# EAGLE design Motor Controller (EAGLE 8.5.1)
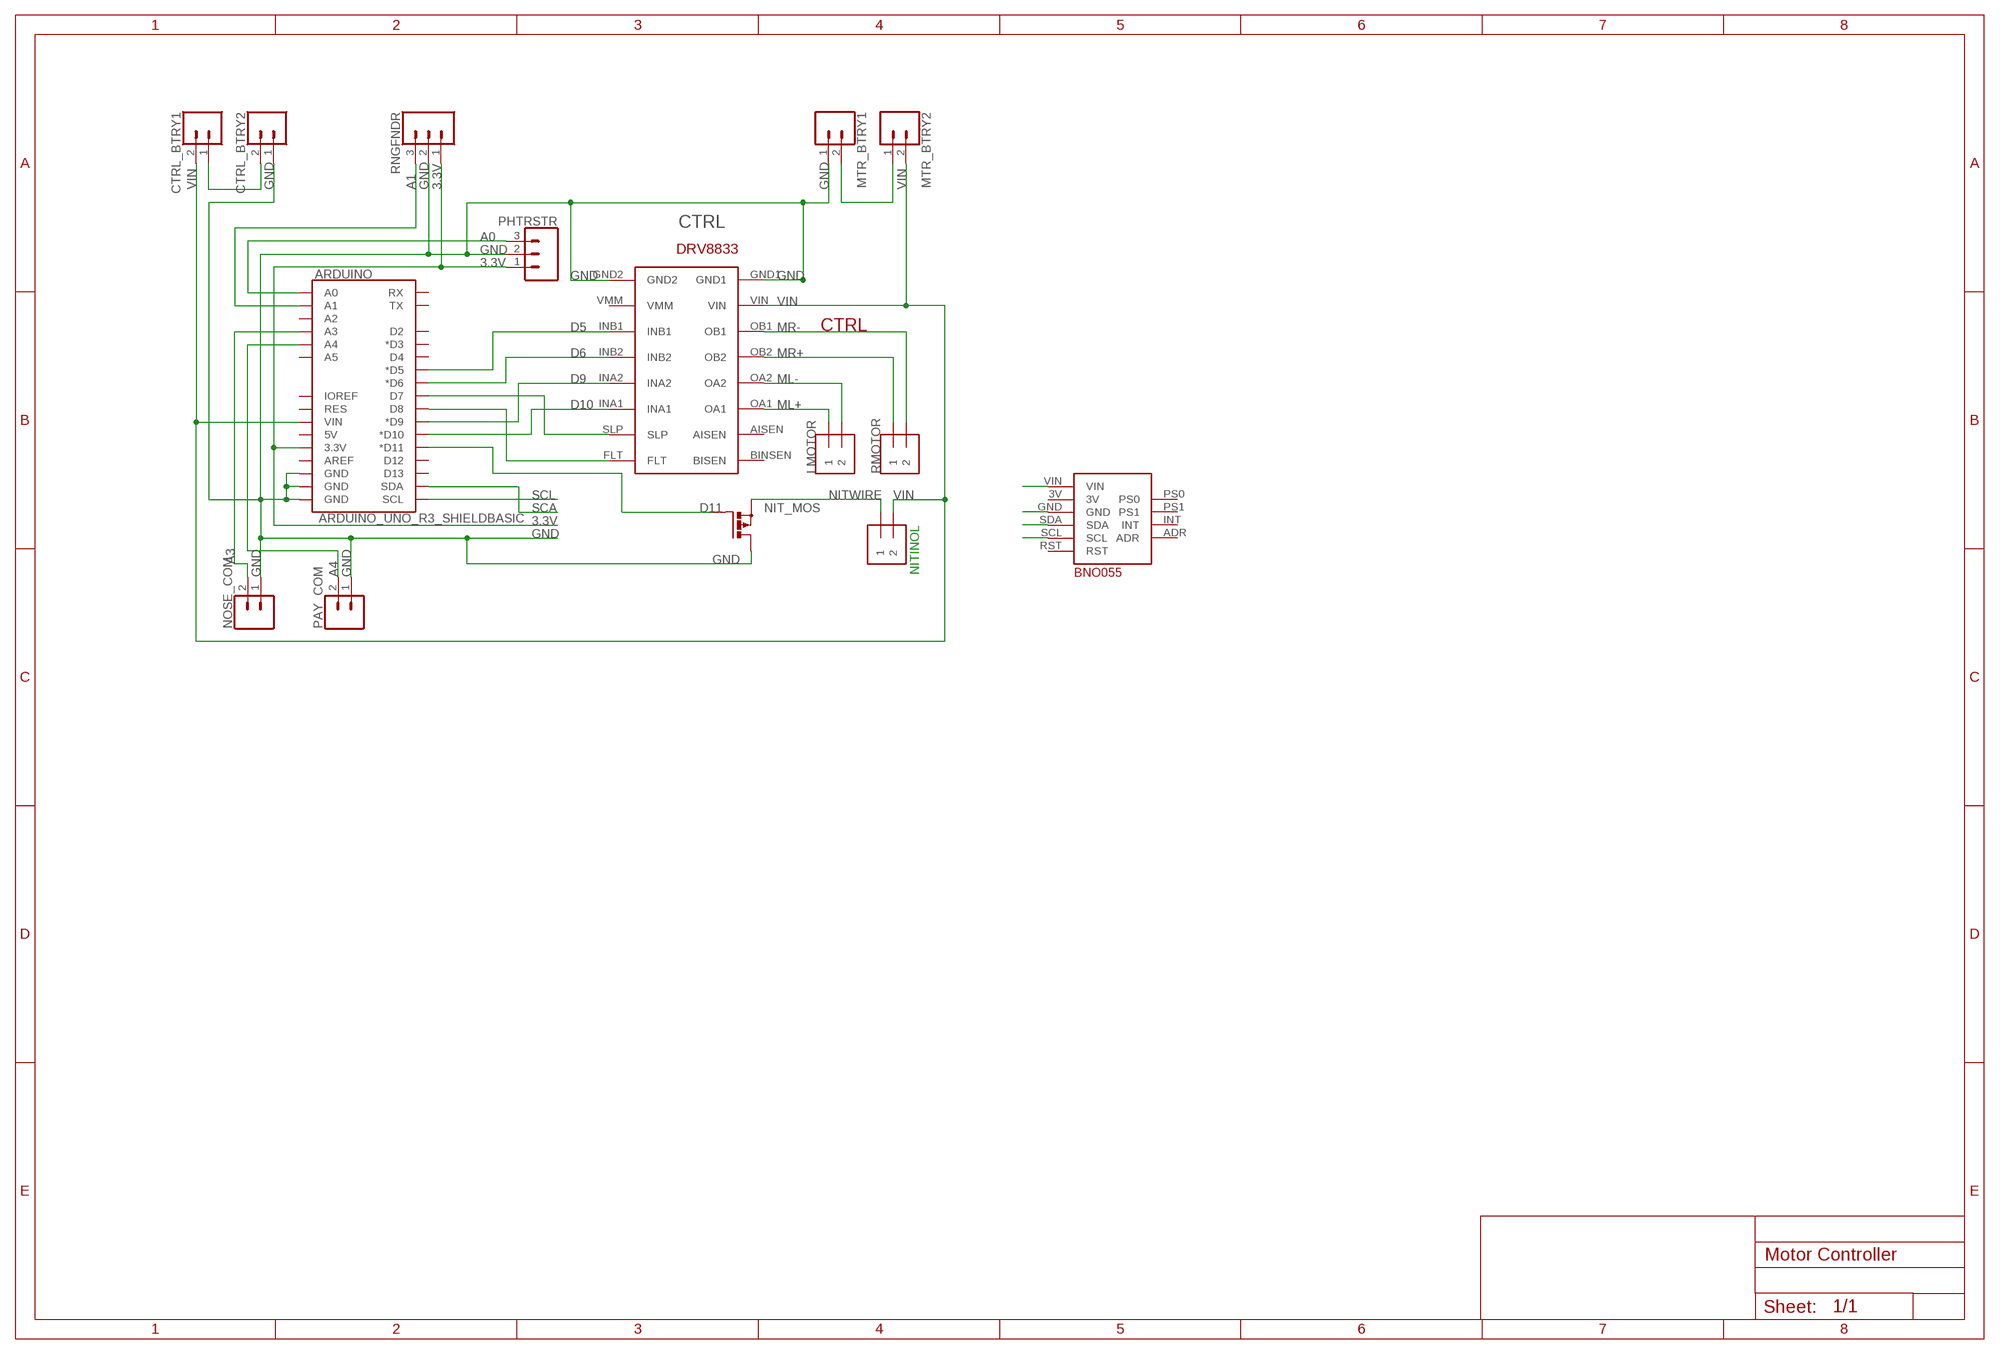
[diagram p0: schematic, sheet 1]

## Parts
ARDUINO  ARDUINO_UNO_R3_SHIELDBASIC  [UNO_R3_SHIELD]
CTRL  POLOLU-DRV8833  [POLOLU-DRV8833]
CTRL_BTRY1  CONN_02-JST-2-PTH-NO_SILK  [JST-2-PTH-NS]
CTRL_BTRY2  CONN_02-JST-2-PTH-NO_SILK  [JST-2-PTH-NS]
LMOTOR  1X2-3.5MM  [1X2-3.5MM]
MTR_BTRY1  CONN_02-JST-2-PTH-NO_SILK  [JST-2-PTH-NS]
MTR_BTRY2  CONN_02-JST-2-PTH-NO_SILK  [JST-2-PTH-NS]
NIT_MOS  PMOSFET_PTO220BH  [TO220BH]
NITINOL  1X2-3.5MM  [1X2-3.5MM]
NOSE_COM  CONN_02JST-PTH-2  [JST-2-PTH]
PAY_COM  CONN_02JST-PTH-2  [JST-2-PTH]
PHTRSTR  CONN_03JST-PTH-NS  [JST-3-PTH-NS]
RMOTOR  1X2-3.5MM  [1X2-3.5MM]
RNGFNDR  CONN_03JST-PTH-NS  [JST-3-PTH-NS]
U$1  BNO055  [BNO055]

## Nets
3.3V: ARDUINO.3.3V PHTRSTR.1 RNGFNDR.1 U$1.VIN
A0: ARDUINO.A0 PHTRSTR.3
A1: ARDUINO.A1 RNGFNDR.3
A3: ARDUINO.A3 NOSE_COM.2
A4: ARDUINO.A4 PAY_COM.2
BAT_INT1: MTR_BTRY1.2 MTR_BTRY2.1
BAT_INT2: CTRL_BTRY1.1 CTRL_BTRY2.2
D5: ARDUINO.D5(*D5) CTRL.INB1
D6: ARDUINO.D6(*D6) CTRL.INB2
D9: ARDUINO.D9(*D9) CTRL.INA2
D10: ARDUINO.D10(*D10) CTRL.INA1
D11: ARDUINO.D11(*D11) NIT_MOS.G
GND: ARDUINO.GND@0(GND) ARDUINO.GND@1(GND) ARDUINO.GND@2(GND) CTRL.GND1 CTRL.GND2 CTRL_BTRY2.1 MTR_BTRY1.1 NIT_MOS.D NOSE_COM.1 PAY_COM.1 PHTRSTR.2 RNGFNDR.2 U$1.GND
ML+: CTRL.OA1 LMOTOR.1
ML-: CTRL.OA2 LMOTOR.2
MR+: CTRL.OB2 RMOTOR.1
MR-: CTRL.OB1 RMOTOR.2
N$2: ARDUINO.D7 CTRL.SLP
N$3: ARDUINO.D8 CTRL.FLT
NITWIRE: NIT_MOS.S NITINOL.1
SCA: ARDUINO.SDA U$1.SDA
SCL: ARDUINO.SCL U$1.SCL
VIN: ARDUINO.VIN CTRL.VIN CTRL_BTRY1.2 MTR_BTRY2.2 NITINOL.2
Unconnected: ARDUINO.5V ARDUINO.A2 ARDUINO.A5 ARDUINO.AREF ARDUINO.D2 ARDUINO.D3(*D3) ARDUINO.D4 ARDUINO.D12 ARDUINO.D13 ARDUINO.IOREF ARDUINO.RES ARDUINO.RX ARDUINO.TX CTRL.AISEN CTRL.BINSEN(BISEN) CTRL.VMM U$1.3V U$1.ADR U$1.INT U$1.PS0 U$1.PS1 U$1.RST

## Notes on the sheet
- LMOTOR | RMOTOR
- NITINOL

## Library data of the parts
ARDUINO = SparkFun-Boards:ARDUINO_UNO_R3_SHIELD: Arduino R3 Shield Footprint Shield form compatible with the Arduino Uno R3. SparkFun Products: MG2639 Cellular Shield <https://www.sparkfun.com/products/13120> MIDI Shield <https://www.sparkfun.com/products/12898> R3 Stackable Headers Kit <https://www.sparkfun.com/products/11417>
CTRL = Pololu_Driver_DRV8833:POLOLU-DRV8833: Created by: Deltarios DRV8833 pololu dual drive controller, PCB-ready device
CTRL_BTRY1 CTRL_BTRY2 MTR_BTRY1 MTR_BTRY2 = SparkFun-Connectors:CONN_02: Multi connection point. Often used as Generic Header-pin footprint for 0.1 inch spaced/style header connections On any of the 0.1 inch spaced packages, you can populate with these: Break Away Headers - Straight <https://www.sparkfun.com/products/116> (PRT-00116) Break Away Male Headers - Right Angle <https://www.sparkfun.com/products/553> (PRT-00553) Female Headers <https://www.sparkfun.com/products/115> (PRT-00115) Break Away Headers - Machine Pin <https://www.sparkfun.com/products/117> (PRT-00117) Break Away Female Headers - Swiss Machine Pin <https://www.sparkfun.com/products/743> (PRT-00743) For SCREWTERMINALS and SPRING TERMINALS visit here: Screw Terimnals on SparkFun.com <https://www.sparkfun.com/search/results?term=Screw+Terminals> (5mm/3.5mm/2.54mm spacing) This device is also useful as a general connection point to wire up your design to another part of your project. Our various solder wires solder well into these plated through hole pads. Hook-Up Wire - Assortment (Stranded, 22 AWG) <https://www.sparkfun.com/products/11375> (PRT-11375) Hook-Up Wire - Assortment (Solid Core, 22 AWG) <https://www.sparkfun.com/products/11367> (PRT-11367) View the entire wire category on our website here <https://www.sparkfun.com/categories/141> Special notes: Molex polarized connector foot print use with: PRT-08233 with associated crimp pins and housings. 2.54_SCREWTERM for use with PRT-10571. 3.5mm Screw Terminal footprints for PRT-08084 5mm Screw Terminal footprints for use with PRT-08432
LMOTOR NITINOL RMOTOR = adafruit:1X2: 3.5mm Terminal block http://www.ladyada.net/library/pcb/eaglelibrary.html
NIT_MOS = transistor-power:PMOSFET_P: Power MOSFET P-Channel
NOSE_COM PAY_COM = SparkFun-Connectors:CONN_02: Multi connection point. Often used as Generic Header-pin footprint for 0.1 inch spaced/style header connections On any of the 0.1 inch spaced packages, you can populate with these: Break Away Headers - Straight <https://www.sparkfun.com/products/116> (PRT-00116) Break Away Male Headers - Right Angle <https://www.sparkfun.com/products/553> (PRT-00553) Female Headers <https://www.sparkfun.com/products/115> (PRT-00115) Break Away Headers - Machine Pin <https://www.sparkfun.com/products/117> (PRT-00117) Break Away Female Headers - Swiss Machine Pin <https://www.sparkfun.com/products/743> (PRT-00743) For SCREWTERMINALS and SPRING TERMINALS visit here: Screw Terimnals on SparkFun.com <https://www.sparkfun.com/search/results?term=Screw+Terminals> (5mm/3.5mm/2.54mm spacing) This device is also useful as a general connection point to wire up your design to another part of your project. Our various solder wires solder well into these plated through hole pads. Hook-Up Wire - Assortment (Stranded, 22 AWG) <https://www.sparkfun.com/products/11375> (PRT-11375) Hook-Up Wire - Assortment (Solid Core, 22 AWG) <https://www.sparkfun.com/products/11367> (PRT-11367) View the entire wire category on our website here <https://www.sparkfun.com/categories/141> Special notes: Molex polarized connector foot print use with: PRT-08233 with associated crimp pins and housings. 2.54_SCREWTERM for use with PRT-10571. 3.5mm Screw Terminal footprints for PRT-08084 5mm Screw Terminal footprints for use with PRT-08432; PROD_ID: CONN-09863; SKU: PRT-09914
PHTRSTR RNGFNDR = SparkFun-Connectors:CONN_03: Multi connection point. Often used as Generic Header-pin footprint for 0.1 inch spaced/style header connections On any of the 0.1 inch spaced packages, you can populate with these: Break Away Headers - Straight <https://www.sparkfun.com/products/116> (PRT-00116) Break Away Male Headers - Right Angle <https://www.sparkfun.com/products/553> (PRT-00553) Female Headers <https://www.sparkfun.com/products/115> (PRT-00115) Break Away Headers - Machine Pin <https://www.sparkfun.com/products/117> (PRT-00117) Break Away Female Headers - Swiss Machine Pin <https://www.sparkfun.com/products/743> (PRT-00743) Stackable Header - 3 Pin (Female, 0.1") <https://www.sparkfun.com/products/13875> (PRT-13875) For SCREWTERMINALS and SPRING TERMINALS visit here: Screw Terimnals on SparkFun.com <https://www.sparkfun.com/search/results?term=Screw+Terminals> (5mm/3.5mm/2.54mm spacing) This device is also useful as a general connection point to wire up your design to another part of your project. Our various solder wires solder well into these plated through hole pads. Hook-Up Wire - Assortment (Stranded, 22 AWG) <https://www.sparkfun.com/products/11375> (PRT-11375) Hook-Up Wire - Assortment (Solid Core, 22 AWG) <https://www.sparkfun.com/products/11367> (PRT-11367) View the entire wire category on our website here <https://www.sparkfun.com/categories/141> Special notes: Molex polarized connector foot print use with SKU : PRT-08232 with associated crimp pins and housings.
U$1 = IchiCustoms:BNO055

## Board
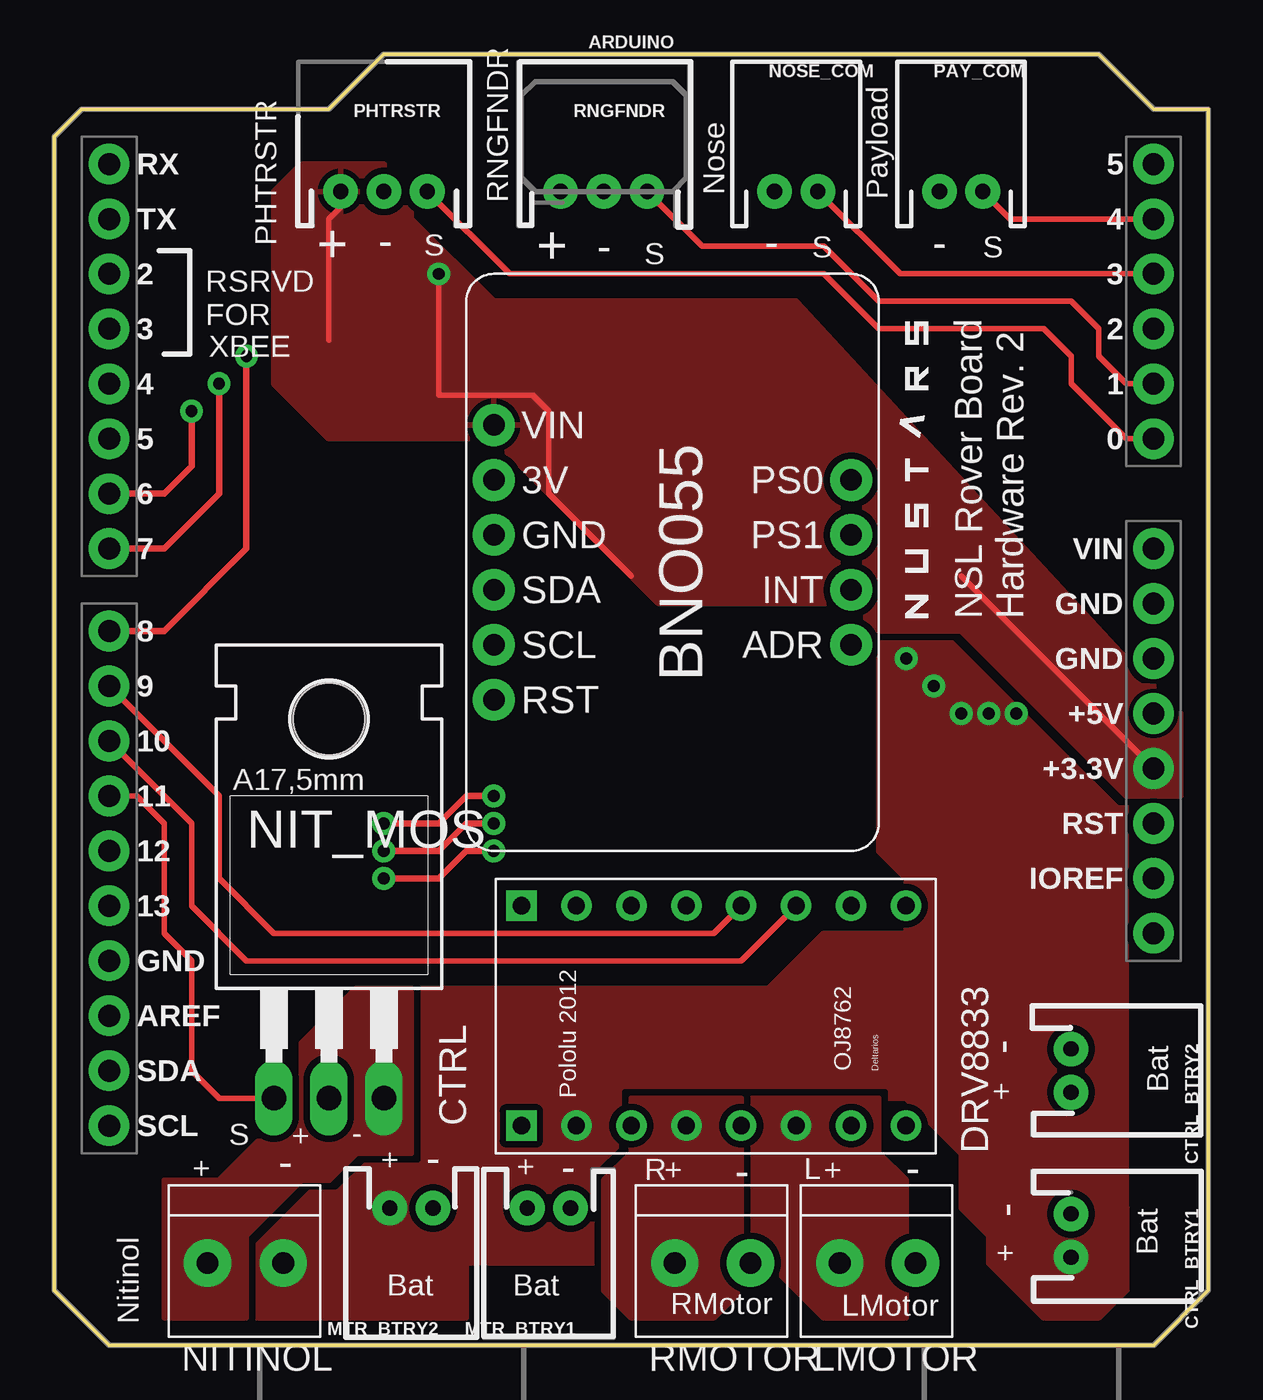
[diagram p1: board, top side]
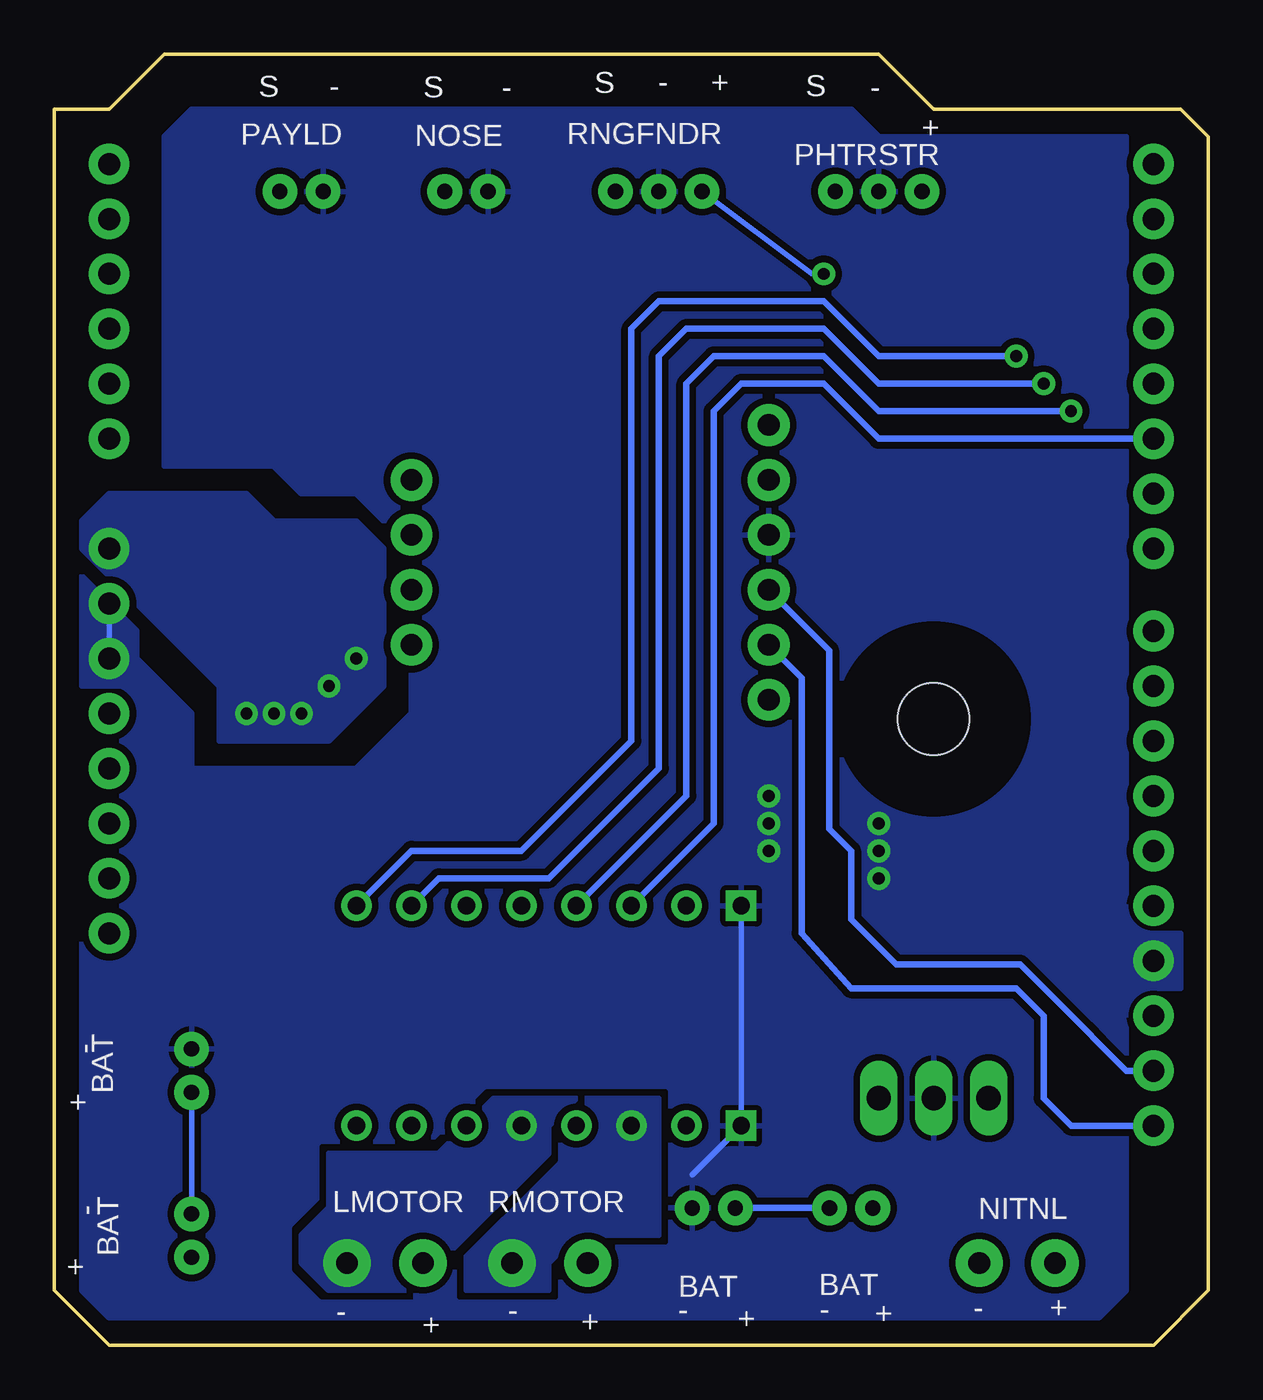
[diagram p2: board, bottom side, seen from below]

Size 53.34 x 59.69 mm. Coordinates in mm from the lower left corner, seen from the top.
Outline: 0,2.54 2.54,0 50.8,0 53.34,2.54 53.34,57.15 50.8,57.15 48.26,59.69 15.24,59.69 12.7,57.15 1.27,57.15 0,55.88 0,2.54
Copper layers (1*16): Top 0.035mm / dielectric 1.5mm / Bottom 0.035mm
Design rules "SparkFun": minimum track width 8mil, minimum drill 20mil, track to track 8mil, track to pad 8mil, pad to pad 8mil, via to via 8mil, smd to smd 8mil, copper to edge 10mil, drill to drill 8mil, minimum pad ring 12mil, minimum via ring 10mil, stop-mask expansion 4mil, vias tented up to drill 25mil, thermal gap 10mil

### Footprints (pad centres in the part's own frame; a part is rotated, then mirrored left to right if it is on the bottom)
UNO_R3_SHIELD = drill 1.016 pad 1.88: 3.3V 24.13,-2.54; 5V 24.13,0; A0 24.13,12.7; A1 24.13,15.24; A2 24.13,17.78; A3 24.13,20.32; A4 24.13,22.86; A5 24.13,25.4; AREF -24.13,-13.97; D2 -24.13,20.32; D3 -24.13,17.78; D4 -24.13,15.24; D5 -24.13,12.7; D6 -24.13,10.16; D7 -24.13,7.62; D8 -24.13,3.81; D9 -24.13,1.27; D10 -24.13,-1.27; D11 -24.13,-3.81; D12 -24.13,-6.35; D13 -24.13,-8.89; GND@0 24.13,2.54; GND@1 24.13,5.08; GND@2 -24.13,-11.43; IOREF 24.13,-7.62; NC 24.13,-10.16; RES 24.13,-5.08; RX -24.13,25.4; SCL -24.13,-19.05; SDA -24.13,-16.51; TX -24.13,22.86; VIN 24.13,7.62
POLOLU-DRV8833 = drill 0.8: AISEN -3.81,-7.62; BINSEN -3.81,-10.16; FLT 6.35,-10.16; INA1 6.35,-5.08; INA2 6.35,-2.54; INB1 6.35,2.54; INB2 6.35,0; OA1 -3.81,-5.08; OA2 -3.81,-2.54; OB1 -3.81,2.54; OB2 -3.81,0; SLP 6.35,-7.62; VIN -3.81,5.08; VMM 6.35,5.08 | drill 0.8 square: GND1 -3.81,7.62; GND2 6.35,7.62
JST-2-PTH-NS = drill 0.7 pad 1.6: 1 -1,0; 2 1,0
1X2-3.5MM = drill 1 pad 2.184: 1 1.8,0; 2 -1.7,0
TO220BH = drill 1.118 long: D 0,-6.35; G -2.54,-6.35; S 2.54,-6.35 | hole 3.302: 0,11.176
JST-2-PTH = drill 0.7 pad 1.6: 1 -1,0; 2 1,0
JST-3-PTH-NS = drill 0.7 pad 1.6: 1 -2,0; 2 0,0; 3 2,0
BNO055 = drill 1 pad 1.93: 3V 9.525,1.27; ADR 17.145,17.78; GND 12.065,1.27; INT 14.605,17.78; PS0 9.525,17.78; PS1 12.065,17.78; RST 19.685,1.27; SCL 17.145,1.27; SDA 14.605,1.27; VIN 6.985,1.27

### Placement (x,y rotation side)
ARDUINO  26.67,29.21 0 top
CTRL  29.21,13.97 90 top
CTRL_BTRY1  46.99,5.08 270 top
CTRL_BTRY2  46.99,12.7 270 top
LMOTOR  38.1,3.81 180 top
MTR_BTRY1  22.86,6.35 180 top
MTR_BTRY2  16.51,6.35 180 top
NIT_MOS  12.7,17.78 0 top
NITINOL  8.89,3.81 180 top
NOSE_COM  34.29,53.34 0 top
PAY_COM  41.91,53.34 0 top
PHTRSTR  15.24,53.34 0 top
RMOTOR  30.48,3.81 180 top
RNGFNDR  25.4,53.34 0 top
U$1  19.05,49.53 270 top

### Tracks (layer width: path | path; a pad name or v marks a point on that pad's centre or on a via)
3.3V  (via drill 0.55)
  Top 0.254: ARDUINO.3.3V 41.91,35.56 | 26.67,35.56 22.86,39.37 22.86,43.18 22.12,43.92 17.78,43.92 v17.78,49.53 | 12.7,46.46 12.7,52.07 13.24,52.61 PHTRSTR.1
  Bottom 0.254: v17.78,49.53 18.32,49.53 RNGFNDR.1
  pour Top (no thermals): 44.45,30.48 49.53,25.4 52.07,25.4 52.07,29.21 50.8,30.48
  pour Top (isolate 0.305): 44.45,30.48 41.91,33.02 38.1,33.02 36.83,34.29 27.94,34.29 20.32,41.91 12.7,41.91 10.16,44.45 10.16,53.34 11.43,54.61 15.24,54.61 16.51,53.34 16.51,52.07 20.32,48.26 34.29,48.26 49.53,31.75 50.8,30.48
A0
  Top 0.254: PHTRSTR.3 21.05,49.53 35.56,49.53 38.1,46.99 45.72,46.99 46.99,45.72 46.99,44.45 49.53,41.91 ARDUINO.A0
A1
  Top 0.254: RNGFNDR.3 29.94,50.8 35.56,50.8 38.1,48.26 46.99,48.26 48.26,46.99 48.26,45.72 49.53,44.45 ARDUINO.A1
A3
  Top 0.254: NOSE_COM.2 39.1,49.53 ARDUINO.A3
A4
  Top 0.254: PAY_COM.2 44.18,52.07 ARDUINO.A4
BAT_INT1
  Bottom 0.305: MTR_BTRY2.1 MTR_BTRY1.2
BAT_INT2
  Bottom 0.254: CTRL_BTRY2.2 CTRL_BTRY1.1
D5
  Bottom 0.305: CTRL.INB1 22.86,24.13 22.86,43.18 21.59,44.45 17.78,44.45 15.24,41.91 ARDUINO.D5
D6  (via drill 0.55)
  Top 0.305: v6.35,43.18 6.35,40.64 5.08,39.37 ARDUINO.D6
  Bottom 0.305: v6.35,43.18 15.24,43.18 17.78,45.72 22.86,45.72 24.13,44.45 24.13,25.4 CTRL.INB2
D9
  Top 0.254: ARDUINO.D9 7.62,25.4 7.62,21.59 10.16,19.05 30.48,19.05 CTRL.INA2
D10
  Top 0.254: ARDUINO.D10 6.35,24.13 6.35,20.32 8.89,17.78 31.75,17.78 CTRL.INA1
D11
  Top 0.254: ARDUINO.D11 3.81,25.4 5.08,24.13 5.08,19.05 6.35,17.78 6.35,12.7 7.62,11.43 NIT_MOS.G
GND  (via drill 0.55)
  Top 0.305: v15.24,24.13 17.78,24.13 19.05,25.4 v20.32,25.4 | v20.32,24.13 19.05,24.13 17.78,22.86 v15.24,22.86 | v20.32,22.86 19.05,22.86 17.78,21.59 v15.24,21.59
  Bottom 0.254: 23.86,7.89 CTRL.GND1 CTRL.GND2 | ARDUINO.GND@1 ARDUINO.GND@0
  pour Bottom (isolate 0.305, rank 6): 3.81,55.88 3.81,2.54 5.08,1.27 49.53,1.27 50.8,1.27 52.07,2.54 52.07,3.81 52.07,33.02 50.8,33.02 48.26,30.48 46.99,29.21 46.99,26.67 40.64,26.67 39.37,26.67 36.83,29.21 36.83,36.83 38.1,38.1 39.37,39.37 41.91,39.37 43.18,40.64 48.26,40.64 48.26,55.88 46.99,57.15 16.51,57.15 15.24,55.88
  pour Bottom (no thermals): 49.53,31.75 52.07,34.29 52.07,31.75 52.07,30.48 49.53,30.48
  pour Bottom (no thermals): 3.81,20.32 2.54,19.05 1.27,19.05 1.27,16.51 2.54,16.51 3.81,15.24
  pour Bottom (no thermals): 49.53,31.75 49.53,33.02 52.07,35.56 52.07,34.29 52.07,31.75
ML+
  pour Top (isolate 0.305, rank 2, no thermals): 31.75,11.43 31.75,5.08 35.56,1.27 39.37,1.27 39.37,7.62 38.1,8.89 38.1,11.43
ML-
  pour Bottom (isolate 0.305, no thermals): 30.48,10.16 30.48,8.89 35.56,3.81 35.56,2.54 40.64,2.54 41.91,3.81 41.91,5.08 40.64,6.35 40.64,8.89 35.56,8.89 33.02,11.43 29.21,11.43
MR+
  pour Top (isolate 0.305, no thermals): 25.4,7.62 25.4,2.54 26.67,1.27 30.48,1.27 31.75,2.54 31.75,11.43 26.67,11.43 26.67,8.89
MR-
  pour Bottom (isolate 0.305, rank 2, no thermals): 25.4,11.43 25.4,5.08 29.21,5.08 30.48,3.81 30.48,2.54 34.29,2.54 34.29,5.08 33.02,6.35 29.21,11.43
N$2  (via drill 0.55)
  Top 0.305: v7.62,44.45 7.62,39.37 5.08,36.83 ARDUINO.D7
  Bottom 0.305: CTRL.SLP 35.56,21.59 30.48,21.59 25.4,26.67 25.4,45.72 24.13,46.99 17.77,46.99 15.23,44.45 v7.62,44.45
N$3  (via drill 0.55)
  Top 0.305: v8.89,45.72 8.89,36.83 5.08,33.02 ARDUINO.D8
  Bottom 0.305: v8.89,45.72 15.24,45.72 17.78,48.26 25.4,48.26 26.67,46.99 26.67,27.94 31.75,22.86 36.83,22.86 CTRL.FLT
NITWIRE
  pour Top (isolate 0.305, no thermals): 8.89,1.27 8.89,5.08 11.43,7.62 12.7,7.62 13.97,8.89 16.51,8.89 16.51,16.51 13.97,16.51 11.43,13.97 11.43,11.43 7.62,7.62 5.08,7.62 5.08,1.27
SCA
  Bottom 0.305: U$1.SDA 17.53,32.13 17.53,23.88 16.51,22.86 16.51,19.69 14.43,17.6 8.7,17.6 5.7,14.6 5.08,13.97 3.81,12.7 ARDUINO.SDA
SCL
  Bottom 0.305: U$1.SCL 18.8,30.86 18.8,19.05 16.51,16.51 8.89,16.51 7.62,15.24 7.62,11.43 6.35,10.16 ARDUINO.SCL
VIN  (via drill 0.55)
  other vias: 39.37,31.75 40.64,30.48 41.91,29.21 43.18,29.21 44.45,29.21
  pour Bottom (isolate 0.305, no thermals): 50.8,39.37 52.07,38.1 52.07,36.83 45.72,30.48 45.72,27.94 40.64,27.94 38.1,30.48 38.1,36.83 39.37,38.1 43.18,38.1 44.45,39.37
  pour Top (isolate 0.305, rank 2): 45.72,1.27 48.26,1.27 49.53,2.54 49.53,25.4 41.91,33.02 38.1,33.02 38.1,22.86 39.37,21.59 39.37,19.05 41.91,19.05 41.91,6.35 43.18,5.08 43.18,3.81
  pour Top (isolate 0.305, rank 3, no thermals): 13.97,8.89 13.97,16.51 33.02,16.51 35.56,19.05 41.91,19.05 41.91,8.89 39.37,11.43 25.4,11.43 25.4,8.89
  pour Top (isolate 0.305, rank 3, no thermals): 13.97,12.7 26.67,12.7 26.67,8.89 13.97,8.89
  pour Top (isolate 0.305, rank 3, no thermals): 16.51,12.7 12.7,8.89 12.7,3.81 25.4,3.81 26.67,10.16 24.13,10.16 24.13,11.43 22.86,12.7
  pour Top (isolate 0.305, no thermals): 45.72,6.35 49.53,6.35 49.53,2.54 44.45,2.54 44.45,5.08
  pour Top (isolate 0.305, rank 2, no thermals): 19.05,7.62 11.43,7.62 8.89,5.08 8.89,1.27 19.05,1.27

### Text on the board
tPlace: RNGFNDR | Nose | Payload | PHTRSTR | + | - | S | + | - | S | - | S | - | S | RSRVD | FOR | XBEE | NSL Rover Board / Hardware Rev. 2 | - | + | Bat | S | + | - | - | + | - | + | + | - | R | + | - | L | + | - | - | + | Bat | Bat | Bat | Nitinol | RMotor | LMotor | D:/ichi/Library/Pictures/E89FC659-C5E8-4355-A63B-FB59E9E2BA1C.bmp | D:/ichi/Library/Pictures/E89FC659-C5E8-4355-A63B-FB59E9E2BA1C.bmp | D:/ichi/Library/Pictures/E89FC659-C5E8-4355-A63B-FB59E9E2BA1C.bmp
bPlace: S | + | - | S | - | - | S | - | S | + | RNGFNDR | NOSE | PAYLD | PHTRSTR | - | BAT | + | NITNL | RMOTOR | LMOTOR | - | BAT | BAT | BAT | + | + | + | + | - | - | - | + | - | + | -